# Altium schematic sheet Sheet2.SchDoc: IOT AO THUY SAN
size A3; Author: Nguyen Thanh Quoc; CompanyName: VKU; Address1: Ngu Hanh Son, Da Nang; SheetNumber: 1; SheetTotal: 1
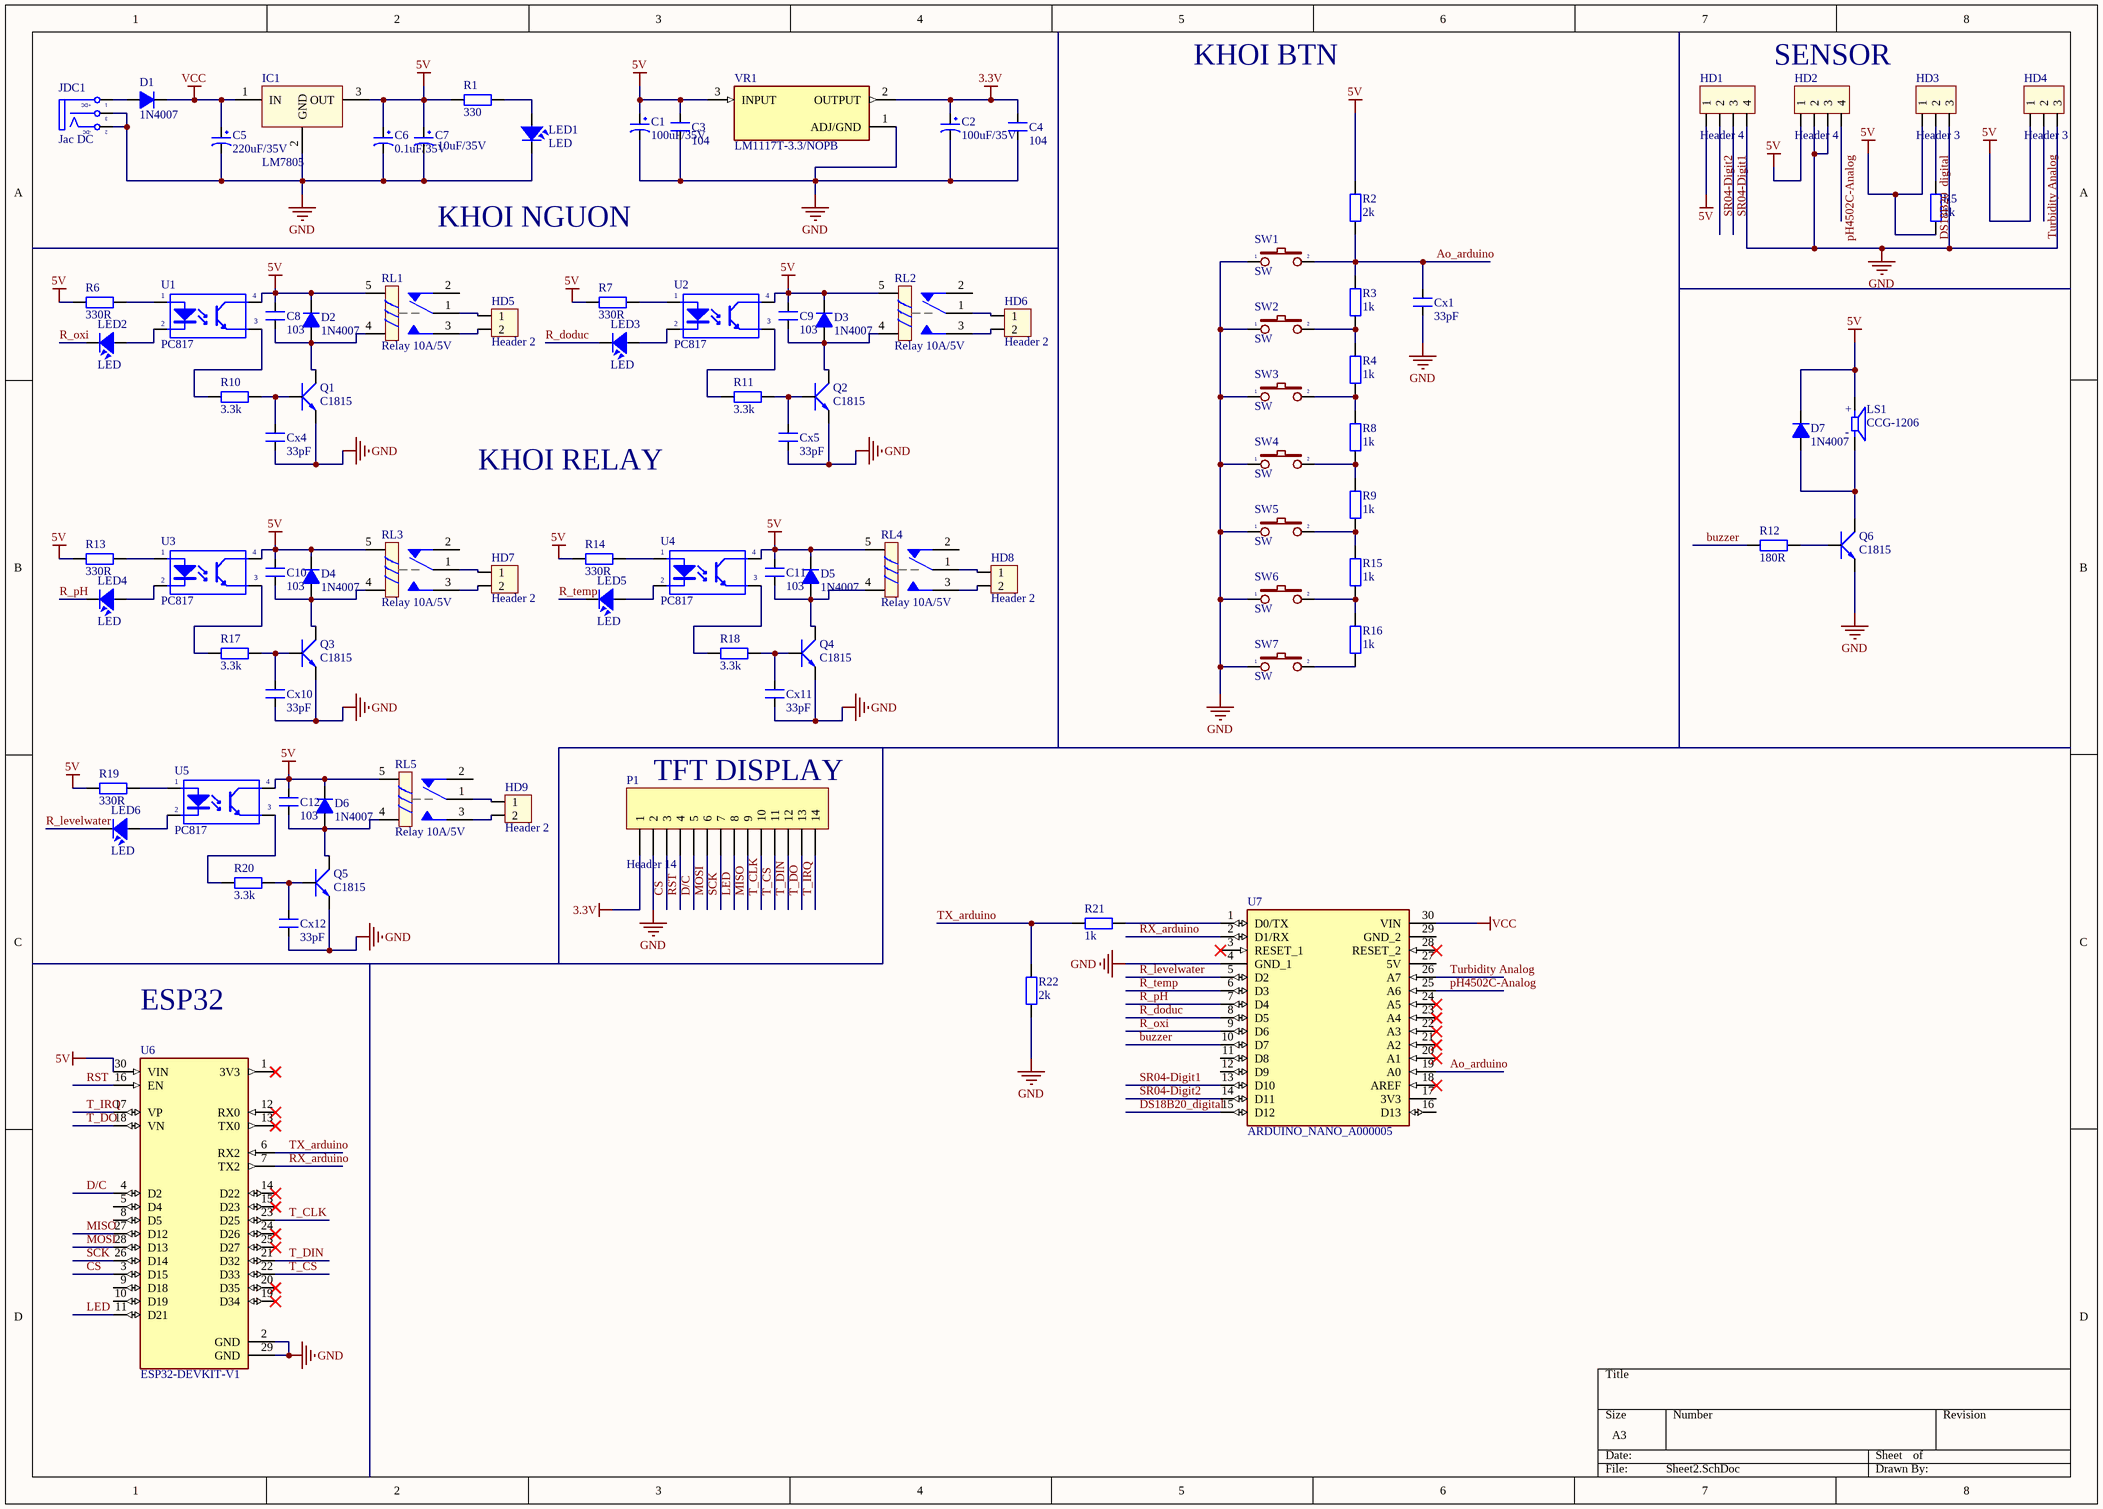
[diagram p0: Sheet2.SchDoc]

## Parts
C1  100uF/35V  [CP1.5/3.4]
C2  100uF/35V  [CP1.5/3.4]
C3  104  [CN2]
C4  104  [CN2]
C5  220uF/35V  [CP1.5/3.4]
C6  0.1uF/35V  [CP1.5/3.4]
C7  10uF/35V  [CP1.5/3.4]
C8  103  [CN1.5]
C9  103  [CN1.5]
C10  103  [CN1.5]
C11  103  [CN1.5]
C12  103  [CN1.5]
Cx1  33pF  [CN1]
Cx4  33pF  [CN1]
Cx5  33pF  [CN1]
Cx10  33pF  [CN1]
Cx11  33pF  [CN1]
Cx12  33pF  [CN1]
D1  1N4007  [D1A]
D2  1N4007  [D1A]
D3  1N4007  [D1A]
D4  1N4007  [D1A]
D5  1N4007  [D1A]
D6  1N4007  [D1A]
D7  1N4007  [D1A]
HD1  Header 4  [HED4]
HD2  Header 4  [HED4]
HD3  Header 3  [HED3]
HD4  Header 3  [HED3]
HD5  Header 2  [HED2]
HD6  Header 2  [HED2]
HD7  Header 2  [HED2]
HD8  Header 2  [HED2]
HD9  Header 2  [HED2]
IC1  LM7805  [QTO-220]
JDC1  Jac DC  [DC-IN]
LED1  LED  [LED-3]
LED2  LED  [LED-3]
LED3  LED  [LED-3]
LED4  LED  [LED-3]
LED5  LED  [LED-3]
LED6  LED  [LED-3]
LS1  CCG-1206  [CUI_CCG-1206]
P1  Header 14  [HDR1X14]
Q1  C1815  [QTO-92]
Q2  C1815  [QTO-92]
Q3  C1815  [QTO-92]
Q4  C1815  [QTO-92]
Q5  C1815  [QTO-92]
Q6  C1815  [QTO-92]
R1  330  [R1/4W]
R2  2k  [R1/4W]
R3  1k  [R1/4W]
R4  1k  [R1/4W]
R5  1k  [R1/4W]
R6  330R  [R1/4W]
R7  330R  [R1/4W]
R8  1k  [R1/4W]
R9  1k  [R1/4W]
R10  3.3k  [R1/4W]
R11  3.3k  [R1/4W]
R12  180R  [R1/4W]
R13  330R  [R1/4W]
R14  330R  [R1/4W]
R15  1k  [R1/4W]
R16  1k  [R1/4W]
R17  3.3k  [R1/4W]
R18  3.3k  [R1/4W]
R19  330R  [R1/4W]
R20  3.3k  [R1/4W]
R21  1k  [R1/4W]
R22  2k  [R1/4W]
RL1  Relay 10A/5V  [RL_SPDT_10A]
RL2  Relay 10A/5V  [RL_SPDT_10A]
RL3  Relay 10A/5V  [RL_SPDT_10A]
RL4  Relay 10A/5V  [RL_SPDT_10A]
RL5  Relay 10A/5V  [RL_SPDT_10A]
SW1  SW  [SW2]
SW2  SW  [SW2]
SW3  SW  [SW2]
SW4  SW  [SW2]
SW5  SW  [SW2]
SW6  SW  [SW2]
SW7  SW  [SW2]
U1  PC817  [DIP4/W0.3]
U2  PC817  [DIP4/W0.3]
U3  PC817  [DIP4/W0.3]
U4  PC817  [DIP4/W0.3]
U5  PC817  [DIP4/W0.3]
U6  ESP32-DEVKIT-V1  [MODULE_ESP32_DEVKIT_V1]
U7  ARDUINO_NANO_A000005  [MODULE_ARDUINO_NANO_A000005]
VR1  LM1117T-3.3/NOPB  [TO254P1054X470X1955-3]

## Nets
3.3V: C2.1 C4.2 P1.1 VR1.2(OUTPUT)
5V: C1.1 C3.2 C6.1 C7.1 C8.1 C9.1 C10.1 C11.1 C12.1 D2.2(K) D3.2(K) D4.2(K) D5.2(K) D6.2(K) D7.2(K) HD1.1 HD2.1 HD3.1 HD4.1 IC1.3(OUT) LS1.P R1.1 R2.2 R5.1 R6.1 R7.1 R13.1 R14.1 R19.1 RL1.5 RL2.5 RL3.5 RL4.5 RL5.5 U1.4(C) U2.4(C) U3.4(C) U4.4(C) U5.4(C) U6.30(VIN) VR1.3(INPUT)
GND: C1.2 C2.2 C3.1 C4.1 C5.2 C6.2 C7.2 Cx1.2 Cx4.2 Cx5.2 Cx10.2 Cx11.2 Cx12.2 HD1.4 HD2.2 HD2.3 HD3.3 HD4.3 IC1.2(GND) JDC1.2(TN) JDC1.3(S) LED1.2 P1.2 Q1.1(E) Q2.1(E) Q3.1(E) Q4.1(E) Q5.1(E) Q6.1(E) R22.2 SW1.1 SW2.1 SW3.1 SW4.1 SW5.1 SW6.1 SW7.1 U6.2(GND) U6.29(GND) U7.4(GND_1) VR1.1(ADJ/GND)
VCC: C5.1 D1.2(K) IC1.1(IN) U7.30(VIN)
Ao_arduino: Cx1.1 R2.1 R3.2 SW1.2 U7.19(A0)
buzzer: R12.2 U7.10(D7)
CS: P1.3 U6.3(D15)
D/C: P1.5 U6.4(D2)
DS18B20_digital: HD3.2 R5.2 U7.15(D12)
LED: P1.8 U6.11(D21)
MISO: P1.9 U6.27(D12)
MOSI: P1.6 U6.28(D13)
pH4502C-Analog: HD2.4 U7.25(A6)
R_doduc: LED3.2 U7.8(D5)
R_levelwater: LED6.2 U7.5(D2)
R_oxi: LED2.2 U7.9(D6)
R_pH: LED4.2 U7.7(D4)
R_temp: LED5.2 U7.6(D3)
RST: P1.4 U6.16(EN)
RX_arduino: U6.7(TX2) U7.2(D1/RX)
SCK: P1.7 U6.26(D14)
SR04-Digit1: HD1.3 U7.13(D10)
SR04-Digit2: HD1.2 U7.14(D11)
T_CLK: P1.10 U6.23(D25)
T_CS: P1.11 U6.22(D33)
T_DIN: P1.12 U6.21(D32)
T_DO: P1.13 U6.18(VN)
T_IRQ: P1.14 U6.17(VP)
Turbidity Analog: HD4.2 U7.26(A7)
TX_arduino: R21.1 R22.1 U6.6(RX2)
NetC8_2: C8.2 D2.1(A) Q1.2(C) RL1.4
NetC9_2: C9.2 D3.1(A) Q2.2(C) RL2.4
NetC10_2: C10.2 D4.1(A) Q3.2(C) RL3.4
NetC11_2: C11.2 D5.1(A) Q4.2(C) RL4.4
NetC12_2: C12.2 D6.1(A) Q5.2(C) RL5.4
NetCx4_1: Cx4.1 Q1.3(B) R10.1
NetCx5_1: Cx5.1 Q2.3(B) R11.1
NetCx10_1: Cx10.1 Q3.3(B) R17.1
NetCx11_1: Cx11.1 Q4.3(B) R18.1
NetCx12_1: Cx12.1 Q5.3(B) R20.1
NetD1_1: D1.1(A) JDC1.1(T)
NetD7_1: D7.1(A) LS1.M Q6.2(C)
NetHD5_1: HD5.1 RL1.1
NetHD5_2: HD5.2 RL1.3
NetHD6_1: HD6.1 RL2.1
NetHD6_2: HD6.2 RL2.3
NetHD7_1: HD7.1 RL3.1
NetHD7_2: HD7.2 RL3.3
NetHD8_1: HD8.1 RL4.1
NetHD8_2: HD8.2 RL4.3
NetHD9_1: HD9.1 RL5.1
NetHD9_2: HD9.2 RL5.3
NetLED1_1: LED1.1 R1.2
NetLED2_1: LED2.1 U1.2(K)
NetLED3_1: LED3.1 U2.2(K)
NetLED4_1: LED4.1 U3.2(K)
NetLED5_1: LED5.1 U4.2(K)
NetLED6_1: LED6.1 U5.2(K)
NetQ6_3: Q6.3(B) R12.1
NetR3_1: R3.1 R4.2 SW2.2
NetR4_1: R4.1 R8.2 SW3.2
NetR6_2: R6.2 U1.1(A)
NetR7_2: R7.2 U2.1(A)
NetR8_1: R8.1 R9.2 SW4.2
NetR9_1: R9.1 R15.2 SW5.2
NetR10_2: R10.2 U1.3(E)
NetR11_2: R11.2 U2.3(E)
NetR13_2: R13.2 U3.1(A)
NetR14_2: R14.2 U4.1(A)
NetR15_1: R15.1 R16.2 SW6.2
NetR16_1: R16.1 SW7.2
NetR17_2: R17.2 U3.3(E)
NetR18_2: R18.2 U4.3(E)
NetR19_2: R19.2 U5.1(A)
NetR20_2: R20.2 U5.3(E)
NetR21_2: R21.2 U7.1(D0/TX)

Not connected (* = marked no-connect by the designer): RL1 2; RL2 2; RL3 2; RL4 2; RL5 2; U6 1(3V3)* 5(D4) 8(D5) 9(D18) 10(D19) 12(RX0)* 13(TX0)* 14(D22)* 15(D23)* 19(D34)* 20(D35)* 24(D26)* 25(D27)*; U7 3(RESET_1)* 11(D8) 12(D9) 16(D13) 17(3V3) 18(AREF)* 20(A1)* 21(A2)* 22(A3)* 23(A4)* 24(A5)* 27(5V) 28(RESET_2)* 29(GND_2)

## Buses and harness runs
bus 

## Notes on the sheet
- KHOI BTN
- SENSOR
- KHOI NGUON
- KHOI RELAY
- TFT DISPLAY
- ESP32
- (in symbol CCG-1206) +; -
- (in symbol DCIN) +DC; -DC

## Library data of the parts
C1 C2 C5-C7 = CP3: Cap 100uF/35V - 470uF/16V; Value: 100uF/35V/50V; Description 1: 1000uF/6,3V - 470uF/16V - 330uF - 25V; Description 2: 220uF/35V - 100uF/50V - 63V - 4,7uF/200V; Description 3: 22uF => 33uF100V - 3,3uF => 4,7uF/250V; Description 4: 2,2uF =>3,3uF/350 - 2,2uF/400V - 1uF/450V
C3 C4 = CN2: Cap np 104 => 105pF; Value: 0.1uF
C8-C12 = CN1.5: Cap np 682pF => 104pF; Value: 0.01uF
Cx1 Cx4 Cx5 Cx10-Cx12 = CN0: Cremic For Xtal 1pF => 100pF; Value: 33pF
D1-D7 = D1A: Diode 1A; Value: 1N4007
HD1 HD2 = Hed4: Header 4 (Green); Value: Header 4
HD3 HD4 = Hed3: Header 3 (Green); Value: Header 3
HD5-HD9 = Hed2: Header 2 (Green); Value: Header 2
IC1 = LM78xx: On ap +, from + 5 to + 24VDC; Value: LM7805
JDC1 = DCIN: Jac DC input; Value: Jac DC
LED1-LED6 = LED: LED Single colour Green and Red; Value: LED 3 ly Single Colour
LS1 = CCG-1206: 12 mm, 5 V, 85 dB, Through Hole, Sealed, Magnetic Audio Transducer Buzzer; Availability: Unavailable; Value: *; Package: None; MP: CCG-1206; Price: None
P1 = Header 14: Header, 14-Pin; LatestRevisionDate: 17-Jul-2002; LatestRevisionNote: Re-released for DXP Platform.; Publisher: Altium Limited
Q1-Q6 = C1815: NPN 600mW, ECB; Value: C1815
R1-R22 = R1/4W: Resistor 1/4W; Value: R1/4W - 1K
RL1-RL5 = Relay 1: Relay SPDT,10A - 12VDC 5 Pin; Value: Relay SPDT, 10A, 12V
SW1-SW7 = SW2: Switch button 2 pin; Value: SW chip 2 pin
U1-U5 = PC817: Single Opto; Value: PC817
U6 = ESP32-DEVKIT-V1: Dual core, Wi-Fi: 2.4 GHz up to 150 Mbits/s,BLE (Bluetooth Low Energy) and legacy Bluetooth, 32 bits, Up to 240 MHz; MF: Do it; Price: None; Availability: Not in stock; Package: None; MP: ESP32-DEVKIT-V1; Value: *; SnapEDA_Link: https://www.snapeda.com/parts/ESP32-DEVKIT-V1/Do+it/view-part/?ref=snap; Check_prices: https://www.snapeda.com/parts/ESP32-DEVKIT-V1/Do+it/view-part/?ref=eda
U7 = ARDUINO_NANO_A000005: ATSAMD21G18A Arduino Nano 33 IoT series ARMÂ® CortexÂ®-M0+ MCU 32-Bit Embedded Evaluation Board; MP: ARDUINO NANO A000005; SnapEDA_Link: https://www.snapeda.com/parts/ARDUINO%20NANO%20A000005/Arduino/view-part/?ref=snap; Package: Non-Standard Arduino; Value: *; MF: Arduino; Check_prices: https://www.snapeda.com/parts/ARDUINO%20NANO%20A000005/Arduino/view-part/?ref=eda
VR1 = LM1117T-3.3/NOPB: 800-mA 15-V linear voltage regulator; MF: Texas Instruments; Package: TO-220-3 Texas Instruments; Price: None; Check_prices: https://www.snapeda.com/parts/LM1117T-3.3/NOPB/Texas+Instruments/view-part/?ref=eda; Value: *; SnapEDA_Link: https://www.snapeda.com/parts/LM1117T-3.3/NOPB/Texas+Instruments/view-part/?ref=snap; MP: LM1117T-3.3/NOPB; Availability: In Stock; Purchase-URL: https://pricing.snapeda.com/search/part/LM1117T-3.3/NOPB/?ref=eda